# Altium schematic sheet tof.SchDoc
size A4
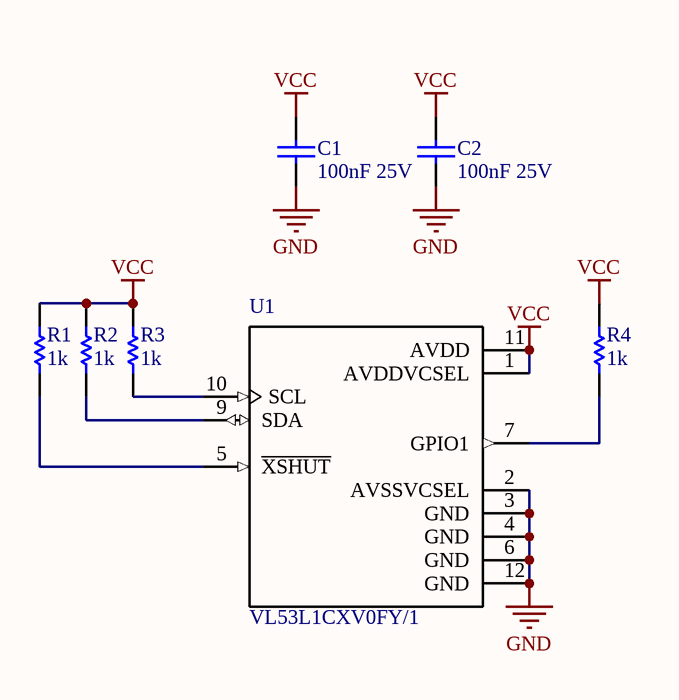
[diagram p0: tof.SchDoc]

## Parts
C1  100nF 25V  [RC_0603]
C2  100nF 25V  [RC_0603]
R1  1k  [rr_0603]
R2  1k  [rr_0603]
R3  1k  [rr_0603]
R4  1k  [rr_0603]
U1  VL53L1CXV0FY/1  [*SENSOR_VL53L1CXV0FY/1]

## Nets
GND: C1.1 C2.1 U1.2(AVSSVCSEL) U1.3(GND) U1.4(GND) U1.6(GND) U1.12(GND)
VCC: C1.2 C2.2 R1.2 R2.2 R3.2 R4.2 U1.1(AVDDVCSEL) U1.11(AVDD)
NetR1_1: R1.1 U1.5(~{XSHUT})
NetR2_1: R2.1 U1.9(SDA)
NetR3_1: R3.1 U1.10(SCL)
NetR4_1: R4.1 U1.7(GPIO1)

## Library data of the parts
C1 C2 = CAP-0603-104-25V: CAPACITOR CHIP; Manufacturer: KEMET; Value: CAP CER 0.1UF 25V X7R 0603; Order Number: C0603C104M4RACTU; Cost: 0,07; Package: 0603
R1-R4 = Res1: Resistor; Manufacturer: Yageo; Order Number: RC0402FR-071KL; Value: RES SMD 1K OHM 1% 1/16W 0402; Cost: 0,1; Package: 0402
U1 = VL53L1CXV0FY/1: / Optical Sensor 157.480 _4m_ IВІC Output /; MF: STMicroelectronics; Package: LGA-12 STMicroelectronics; Price: None; Availability: Unavailable; MP: VL53L1CXV0FY/1; SnapEDA_Link: https://www.snapeda.com/parts/VL53L1CXV0FY/1/STMicroelectronics/view-part/2755611/?ref=snap; Value: *